# EAGLE design bluenumi (EAGLE 6.1)
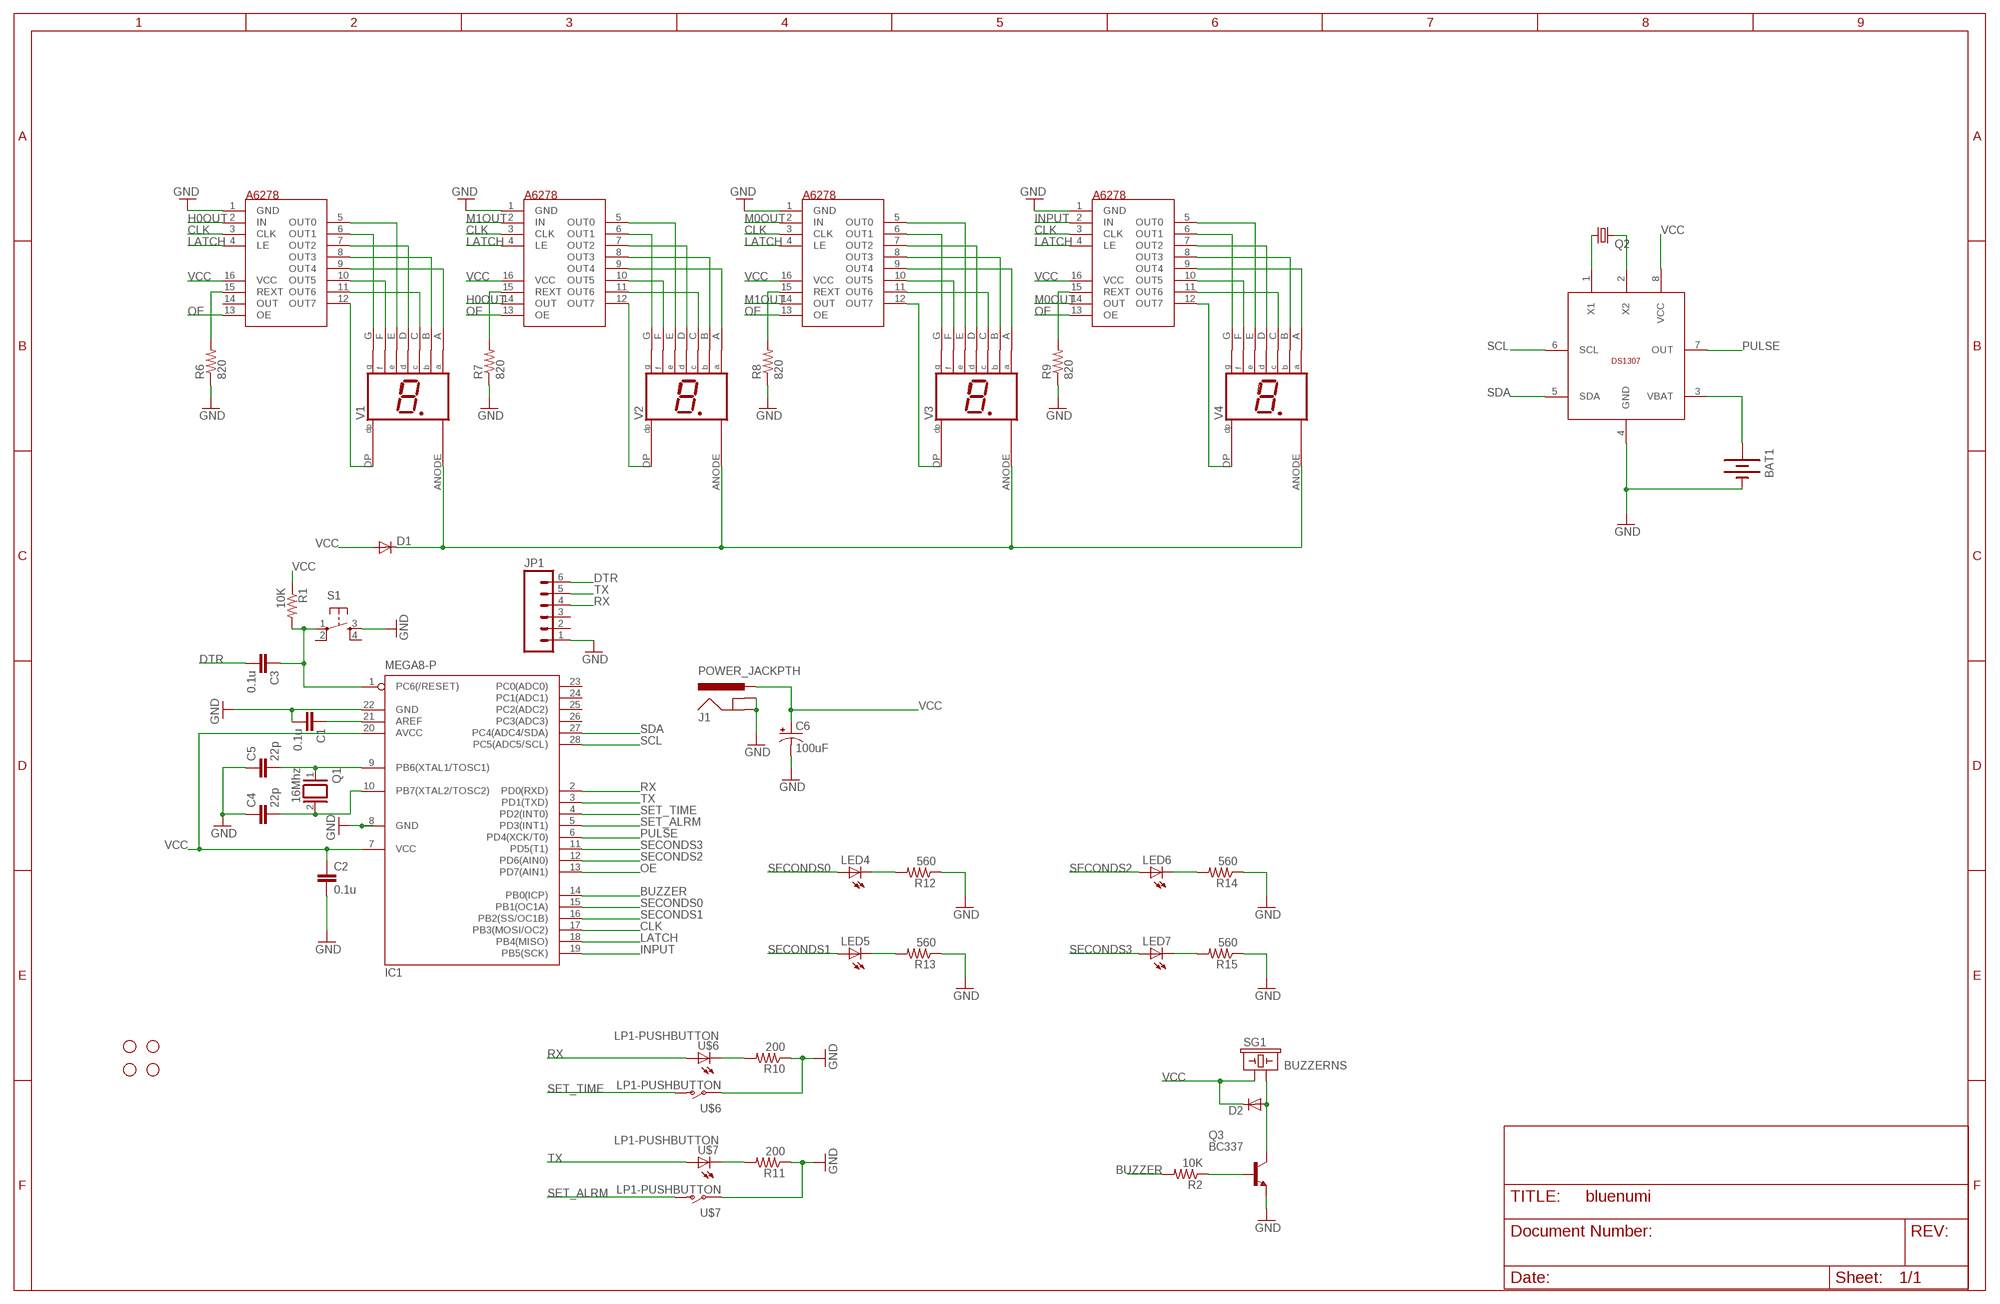
[diagram p0: schematic, sheet 1]

## Parts
BAT1  BATTERY20PTH  [BATTCOM_20MM_PTH]
C1  0.1u  CAPPTH  [CAP-PTH-SMALL]
C2  0.1u  CAPPTH  [CAP-PTH-SMALL]
C3  0.1u  CAPPTH  [CAP-PTH-SMALL]
C4  22p  CAPPTH  [CAP-PTH-SMALL]
C5  22p  CAPPTH  [CAP-PTH-SMALL]
C6  100uF  CAP_POLPTH2  [CPOL-RADIAL-10UF-25V]
D1  DIODEPTH  [DIODE-1N4001]
D2  DIODEPTH  [DIODE-1N4001]
IC1  MEGA8-P  [DIL28-3]
J1  POWER_JACKPTH  [POWER_JACK_PTH]
JP1  M06LOCK  [1X06_LOCK]
LED4  LED5MM  [LED5MM]
LED5  LED5MM  [LED5MM]
LED6  LED5MM  [LED5MM]
LED7  LED5MM  [LED5MM]
Q1  16Mhz  XTAL/S  [QS]
Q2  CRYSTALTC26H  [TC26H]
Q3  BC337  [TO92]
R1  10K  RESISTORPTH1  [AXIAL-0.3]
R2  10K  RESISTORPTH1  [AXIAL-0.3]
R6  820  RESISTORPTH1  [AXIAL-0.3]
R7  820  RESISTORPTH1  [AXIAL-0.3]
R8  820  RESISTORPTH1  [AXIAL-0.3]
R9  820  RESISTORPTH1  [AXIAL-0.3]
R10  200  RESISTORPTH1  [AXIAL-0.3]
R11  200  RESISTORPTH1  [AXIAL-0.3]
R12  560  RESISTORPTH1  [AXIAL-0.3]
R13  560  RESISTORPTH1  [AXIAL-0.3]
R14  560  RESISTORPTH1  [AXIAL-0.3]
R15  560  RESISTORPTH1  [AXIAL-0.3]
S1  TAC_SWITCHPTH  [TACTILE-PTH]
SG1  BUZZERNS  [BUZZER-12MM-NS]
U$1  TLC5916  A6278EAT  [DIL16]
U$2  A6278EAT  [DIL16]
U$3  A6278EAT  [DIL16]
U$4  A6278EAT  [DIL16]
U$5  DS1307  [DIL08]
U$6  LP1-PUSHBUTTON  [LP1-PUSHBUTTON]
U$7  LP1-PUSHBUTTON  [LP1-PUSHBUTTON]
U$8  STAND-OFF  [STAND-OFF]
U$9  STAND-OFF  [STAND-OFF]
U$10  STAND-OFF  [STAND-OFF]
U$11  STAND-OFF  [STAND-OFF]
V1  IV-9-UNDERLIT  [9PINTUBE-WIDE]
V2  IV-9-UNDERLIT  [9PINTUBE-WIDE]
V3  IV-9-UNDERLIT  [9PINTUBE-WIDE]
V4  IV-9-UNDERLIT  [9PINTUBE-WIDE]

## Nets
BUZZER: IC1.14(PB0(ICP)) R2.P$2
CLK: IC1.17(PB3(MOSI/OC2)) U$1.3(CLK) U$2.3(CLK) U$3.3(CLK) U$4.3(CLK)
DTR: C3.2 JP1.6
GND: BAT1.2(-) C1.2 C2.2 C4.1 C5.1 C6.2(-) IC1.8(GND) IC1.22(GND) J1.GND J1.GNDBREAK JP1.1 Q3.1(E) R6.P$1 R7.P$1 R8.P$1 R9.P$1 R10.P$1 R11.P$1 R12.P$1 R13.P$1 R14.P$1 R15.P$1 S1.3 U$1.1(GND) U$2.1(GND) U$3.1(GND) U$4.1(GND) U$5.4(GND) U$6.S2 U$7.S2
H0OUT: U$1.2(IN) U$2.14(OUT)
INPUT: IC1.19(PB5(SCK)) U$4.2(IN)
LATCH: IC1.18(PB4(MISO)) U$1.4(LE) U$2.4(LE) U$3.4(LE) U$4.4(LE)
M0OUT: U$3.2(IN) U$4.14(OUT)
M1OUT: U$2.2(IN) U$3.14(OUT)
N$1: U$1.5(OUT0) V1.E
N$2: U$1.6(OUT1) V1.G
N$3: U$1.7(OUT2) V1.D
N$4: U$1.8(OUT3) V1.B
N$5: U$1.9(OUT4) V1.A
N$6: U$1.10(OUT5) V1.F
N$7: U$1.11(OUT6) V1.C
N$8: U$1.12(OUT7) V1.DP
N$9: R11.P$2 U$7.CATHODE
N$10: U$2.12(OUT7) V2.DP
N$11: C5.2 IC1.9(PB6(XTAL1/TOSC1)) Q1.1
N$12: U$2.6(OUT1) V2.G
N$13: U$2.5(OUT0) V2.E
N$14: U$2.7(OUT2) V2.D
N$15: U$2.8(OUT3) V2.B
N$16: U$2.9(OUT4) V2.A
N$17: U$2.10(OUT5) V2.F
N$18: U$2.11(OUT6) V2.C
N$19: D1.C V1.ANODE V2.ANODE V3.ANODE V4.ANODE
N$20: Q2.1 U$5.1(X1)
N$21: Q2.2 U$5.2(X2)
N$22: C4.2 IC1.10(PB7(XTAL2/TOSC2)) Q1.2
N$23: C3.1 IC1.1(PC6(/RESET)) R1.P$2 S1.1
N$24: C1.1 IC1.21(AREF)
N$25: U$3.12(OUT7) V3.DP
N$26: U$3.11(OUT6) V3.C
N$27: U$3.10(OUT5) V3.F
N$28: U$3.9(OUT4) V3.A
N$29: U$3.8(OUT3) V3.B
N$30: U$3.7(OUT2) V3.D
N$31: U$3.6(OUT1) V3.G
N$32: U$3.5(OUT0) V3.E
N$33: R6.P$2 U$1.15(REXT)
N$34: Q3.2(B) R2.P$1
N$35: D2.A Q3.3(C) SG1.-
N$37: R7.P$2 U$2.15(REXT)
N$38: R8.P$2 U$3.15(REXT)
N$39: R9.P$2 U$4.15(REXT)
N$40: R10.P$2 U$6.CATHODE
N$41: U$4.11(OUT6) V4.C
N$42: U$4.10(OUT5) V4.F
N$43: U$4.9(OUT4) V4.A
N$44: U$4.8(OUT3) V4.B
N$45: U$4.7(OUT2) V4.D
N$46: U$4.6(OUT1) V4.G
N$47: U$4.5(OUT0) V4.E
N$48: LED4.K(C) R12.P$2
N$49: U$4.12(OUT7) V4.DP
N$50: LED5.K(C) R13.P$2
N$51: LED6.K(C) R14.P$2
N$52: LED7.K(C) R15.P$2
N$54: BAT1.1(+) U$5.3(VBAT)
OE: IC1.13(PD7(AIN1)) U$1.13(OE) U$2.13(OE) U$3.13(OE) U$4.13(OE)
PULSE: IC1.6(PD4(XCK/T0)) U$5.7(OUT)
RX: IC1.2(PD0(RXD)) JP1.4 U$6.ANODE
SCL: IC1.28(PC5(ADC5/SCL)) U$5.6(SCL)
SDA: IC1.27(PC4(ADC4/SDA)) U$5.5(SDA)
SECONDS0: IC1.15(PB1(OC1A)) LED4.A
SECONDS1: IC1.16(PB2(SS/OC1B)) LED5.A
SECONDS2: IC1.12(PD6(AIN0)) LED6.A
SECONDS3: IC1.11(PD5(T1)) LED7.A
SET_ALRM: IC1.5(PD3(INT1)) U$7.S1
SET_TIME: IC1.4(PD2(INT0)) U$6.S1
TX: IC1.3(PD1(TXD)) JP1.5 U$7.ANODE
VCC: C2.1 C6.1(+) D1.A D2.C IC1.7(VCC) IC1.20(AVCC) J1.PWR R1.P$1 SG1.+ U$1.16(VCC) U$2.16(VCC) U$3.16(VCC) U$4.16(VCC) U$5.8(VCC)
Unconnected: IC1.23(PC0(ADC0)) IC1.24(PC1(ADC1)) IC1.25(PC2(ADC2)) IC1.26(PC3(ADC3)) JP1.2 JP1.3 S1.2 S1.4 U$1.14(OUT)

## Library data of the parts
BAT1 = SparkFun:BATTERY: Battery Holders Various common sizes : AA, AAA, 20mm coin cell and 12mm coin cell.
C1-C5 = SparkFun:CAP: Capacitor Standard 0603 ceramic capacitor, and 0.1" leaded capacitor.
C6 = SparkFun:CAP_POL: Capacitor Polarized These are standard SMD and PTH capacitors. Normally 10uF, 47uF, and 100uF in electrolytic and tantalum varieties. Always verify the external diameter of the through hole cap, it varies with capacity, voltage, and manufacturer. The EIA devices should be standard.
D1 D2 = SparkFun:DIODE: Diode These are standard reverse protection diodes and small signal diodes. SMA package can handle up to about 1A. SOD-323 can handle about 200mA. What the SOD-323 package when ordering, there are some mfgs out there that are 5-pin packages.
IC1 = atmel:MEGA8-P: MICROCONTROLLER 8 Kbytes FLASH, 1 kbytes SRAM, 512 bytes EEPROM, USART, 4-channel 10 bit ADC, 2-channel 8 bit ADC Pin compatible with Atmega48, ATMega88, ATMega168 Source: avr.lbr
J1 = SparkFun:POWER_JACK: Power Jack This is the standard 5.5mm barrel jack for power. The PTH is the most common, proven, reliable, footprint. All others are experimental. The Slot footprint only works if the mill layer is transmitted to the PCB fab house so be warned. Spark Fun Electronics SKU : PRT-00119. Mating wall wart : TOL-00298 (and others)
JP1 = SparkFun:M06: Header 6 Standard 6-pin 0.1" header. Use with straight break away headers (SKU : PRT-00116), right angle break away headers (PRT-00553), swiss pins (PRT-00743), machine pins (PRT-00117), and female headers (PRT-00115). Molex polarized connector foot print use with SKU : PRT-08094 with associated crimp pins and housings. NOTES ON THE VARIANTS LOCK and LOCK_LONGPADS... This footprint was designed to help hold the alignment of a through-hole component (i.e. 6-pin header) while soldering it into place. You may notice that each hole has been shifted either up or down by 0.005 of an inch from it's more standard position (which is a perfectly straight line). This slight alteration caused the pins (the squares in the middle) to touch the edges of the holes. Because they are alternating, it causes a "brace" to hold the component in place. 0.005 has proven to be the perfect amount of "off-center" position when using our standard breakaway headers. Although looks a little odd when you look at the bare footprint, once you have a header in there, the alteration is very hard to notice. Also, if you push a header all the way into place, it is covered up entirely on the bottom side. This idea of altering the position of holes to aid alignment will be further integrated into the Sparkfun Library for other footprints. It can help hold any component with 3 or more connection pins.
LED4-LED7 = led:LED: LED OSRAM: - CHIPLED LG R971, LG N971, LY N971, LG Q971, LY Q971, LO R971, LY R971 LH N974, LH R974 LS Q976, LO Q976, LY Q976 LO Q996 - Hyper CHIPLED LW Q18S LB Q993, LB Q99A, LB R99A - SideLED LS A670, LO A670, LY A670, LG A670, LP A670 LB A673, LV A673, LT A673, LW A673 LH A674 LY A675 LS A676, LA A676, LO A676, LY A676, LW A676 LS A679, LY A679, LG A679 - Hyper Micro SIDELED® LS Y876, LA Y876, LO Y876, LY Y876 LT Y87S - SmartLED LW L88C, LW L88S LB L89C, LB L89S, LG L890 LS L89K, LO L89K, LY L89K LS L896, LA L896, LO L896, LY L896 - TOPLED LS T670, LO T670, LY T670, LG T670, LP T670 LSG T670, LSP T670, LSY T670, LOP T670, LYG T670 LG T671, LOG T671, LSG T671 LB T673, LV T673, LT T673, LW T673 LH T674 LS T676, LA T676, LO T676, LY T676, LB T676, LH T676, LSB T676, LW T676 LB T67C, LV T67C, LT T67C, LS T67K, LO T67K, LY T67K, LW E67C LS E67B, LA E67B, LO E67B, LY E67B, LB E67C, LV E67C, LT E67C LW T67C LS T679, LY T679, LG T679 LS T770, LO T770, LY T770, LG T770, LP T770 LB T773, LV T773, LT T773, LW T773 LH T774 LS E675, LA E675, LY E675, LS T675 LS T776, LA T776, LO T776, LY T776, LB T776 LHGB T686 LT T68C, LB T68C - Hyper Mini TOPLED® LB M676 - Mini TOPLED Santana® LG M470 LS M47K, LO M47K, LY M47K Source: http://www.osram.convergy.de LUXEON: - LUMILED® LXK2-PW12-R00, LXK2-PW12-S00, LXK2-PW14-U00, LXK2-PW14-V00 LXK2-PM12-R00, LXK2-PM12-S00, LXK2-PM14-U00 LXK2-PE12-Q00, LXK2-PE12-R00, LXK2-PE12-S00, LXK2-PE14-T00, LXK2-PE14-U00 LXK2-PB12-K00, LXK2-PB12-L00, LXK2-PB12-M00, LXK2-PB14-N00, LXK2-PB14-P00, LXK2-PB14-Q00 LXK2-PR12-L00, LXK2-PR12-M00, LXK2-PR14-Q00, LXK2-PR14-R00 LXK2-PD12-Q00, LXK2-PD12-R00, LXK2-PD12-S00 LXK2-PH12-R00, LXK2-PH12-S00 LXK2-PL12-P00, LXK2-PL12-Q00, LXK2-PL12-R00 Source: www.luxeon.com KINGBRIGHT: KA-3528ASYC Source: www.kingbright.com
Q1 = special:XTAL/S: CRYSTAL
Q2 = crystal:CRYSTAL: CRYSTAL
Q3 = transistor-npn:BC337*: NPN Transistor
R1 R2 R6-R15 = SparkFun:RESISTOR: Resistor Basic schematic elements and footprints for 0603, 1206, and PTH 1/10th watt (small) resistors.
S1 = SparkFun:TAC_SWITCH: Momentary Switch Button commonly used for reset or general input. Spark Fun Electronics SKU : COM-00097
SG1 = SparkFun:BUZZER: Buzzer 12mm Spark Fun Electronics SKU : Comp-Buzzer
U$1-U$4 = SeanVoisen:A6278: Allegro A6278 DIP-16 LED driver.
U$5 = SeanVoisen:DS1307: DS1307 Maxim Dallas RTC
U$6 U$7 = SeanVoisen:LP1-PUSHBUTTON
U$8-U$11 = SparkFun:STAND-OFF: Stand Off This is the mechanical footprint for a #4 phillips button head screw. Use the keepout ring to avoid running the screw head into surrounding components. SKU : PRT-00447
V1-V4 = SeanVoisen:IV-9-UNDERLIT

## Board
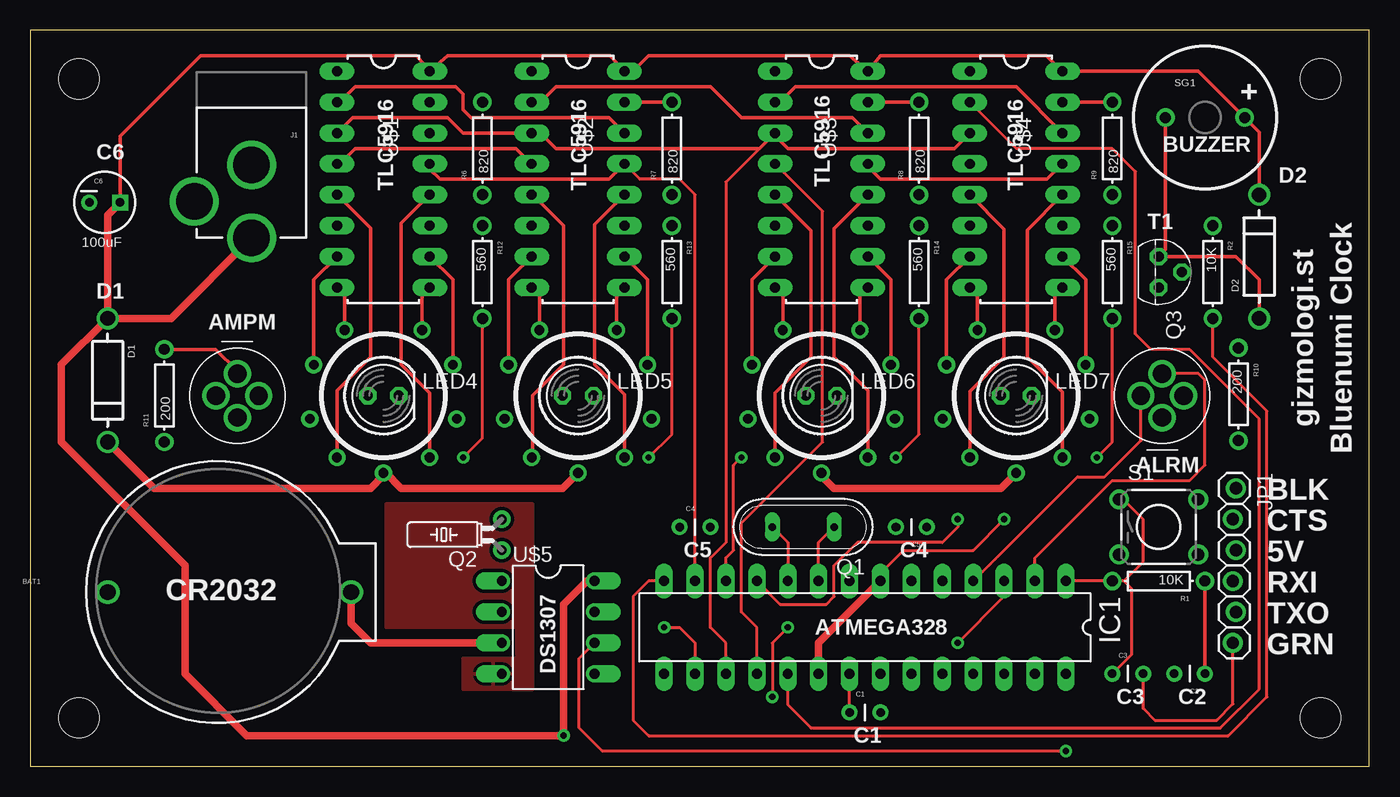
[diagram p1: board, top side]
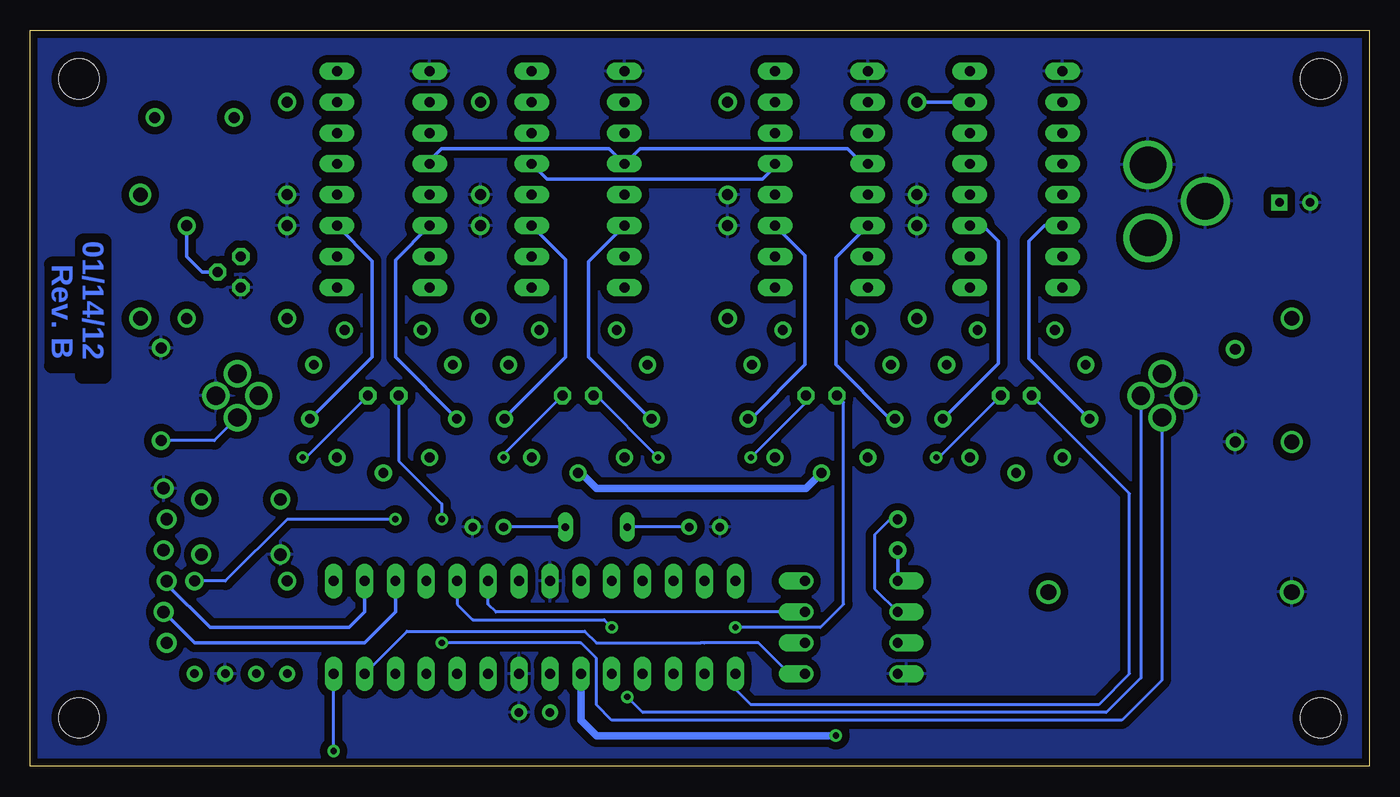
[diagram p2: board, bottom side, seen from below]

Size 110 x 60.5 mm. Coordinates in mm from the lower left corner, seen from the top.
Outline: 0,0 110,0 110,60.5 0,60.5 0,0
Copper layers (1*16): Top 0.035mm / dielectric 1.5mm / Bottom 0.035mm
Design rules: minimum track width 8mil, minimum drill 20mil, track to track 8mil, track to pad 8mil, pad to pad 8mil, via to via 8mil, smd to smd 8mil, copper to edge 10mil, drill to drill 8mil, minimum pad ring 12mil, minimum via ring 10mil, stop-mask expansion 4mil, vias tented up to drill 25mil, thermal gap 10mil

### Footprints (pad centres in the part's own frame; a part is rotated, then mirrored left to right if it is on the bottom)
BATTCOM_20MM_PTH = drill 1.3: 1 20,0; 2 0,0
CAP-PTH-SMALL = drill 0.7: 1 0,0; 2 2.54,0
CPOL-RADIAL-10UF-25V = drill 0.7 square: 1 1.27,0 | drill 0.7: 2 -1.27,0
DIODE-1N4001 = drill 1.2: A -5.08,0; C 5.08,0
DIL28-3 = drill 0.813 long: 1 -16.51,-3.81; 2 -13.97,-3.81; 3 -11.43,-3.81; 4 -8.89,-3.81; 5 -6.35,-3.81; 6 -3.81,-3.81; 7 -1.27,-3.81; 8 1.27,-3.81; 9 3.81,-3.81; 10 6.35,-3.81; 11 8.89,-3.81; 12 11.43,-3.81; 13 13.97,-3.81; 14 16.51,-3.81; 15 16.51,3.81; 16 13.97,3.81; 17 11.43,3.81; 18 8.89,3.81; 19 6.35,3.81; 20 3.81,3.81; 21 1.27,3.81; 22 -1.27,3.81; 23 -3.81,3.81; 24 -6.35,3.81; 25 -8.89,3.81; 26 -11.43,3.81; 27 -13.97,3.81; 28 -16.51,3.81
POWER_JACK_PTH = drill 2.997: GND 0,7.7; GNDBREAK 4.7,10.7; PWR 0,13.7
1X06_LOCK = drill 1.016: 1 0,0; 2 2.54,-0.254; 3 5.08,0; 4 7.62,-0.254; 5 10.16,0; 6 12.7,-0.254
LED5MM = drill 0.813 octagon: A -1.27,0; K 1.27,0
QS = drill 0.61 long: 1 -2.54,0; 2 2.54,0
TC26H = drill 0.813: 1 -1.27,0; 2 1.27,0
TO92 = drill 0.813 octagon: 1 1.27,0; 2 0,1.905; 3 -1.27,0
AXIAL-0.3 = drill 0.9: P$1 -3.81,0; P$2 3.81,0
TACTILE-PTH = drill 1.016: 1 -3.251,2.261; 2 3.251,2.261; 3 -3.251,-2.261; 4 3.251,-2.261
BUZZER-12MM-NS = drill 0.9: + 3.25,0; - -3.25,0
DIL16 = drill 0.813 long: 1 -8.89,-3.81; 2 -6.35,-3.81; 3 -3.81,-3.81; 4 -1.27,-3.81; 5 1.27,-3.81; 6 3.81,-3.81; 7 6.35,-3.81; 8 8.89,-3.81; 9 8.89,3.81; 10 6.35,3.81; 11 3.81,3.81; 12 1.27,3.81; 13 -1.27,3.81; 14 -3.81,3.81; 15 -6.35,3.81; 16 -8.89,3.81
DIL08 = drill 0.813 offset: 1 -3.81,-3.81; 2 -1.27,-3.81; 3 1.27,-3.81; 4 3.81,-3.81; 5 3.81,3.81; 6 1.27,3.81; 7 -1.27,3.81; 8 -3.81,3.81
LP1-PUSHBUTTON = drill 1.5: ANODE 0,1.803; CATHODE 0,-1.803; S1 -1.753,0; S2 1.753,0
STAND-OFF = hole 3.302: 0,0
9PINTUBE-WIDE = drill 0.8: A 3.175,5.397; ANODE 0,-6.35; B -3.175,5.397; C 6.032,-1.905; D -5.715,2.54; DP 3.81,-5.08; E -3.81,-5.08; F 5.715,2.54; G -6.032,-1.905

### Placement (x,y rotation side)
BAT1  6.35,14.34 0 top
C1  67.31,4.45 0 top
C2  96.52,7.62 180 top
C3  88.9,7.62 0 top
C4  53.34,19.68 0 top
C5  73.66,19.68 180 top
C6  6.11,46.35 0 top
D1  6.35,31.75 270 top
D2  100.97,41.91 90 top
IC1  68.58,11.43 180 top
J1  18.17,57.15 180 top
JP1  99.06,22.86 270 top
LED4  29,30.48 0 top
LED5  45,30.48 0 top
LED6  65,30.48 0 top
LED7  81,30.48 0 top
Q1  63.5,19.68 180 top
Q2  38.73,19.05 90 top
Q3  92.71,40.64 270 top
R1  92.71,15.24 180 top
R2  97.16,40.64 270 top
R6  37.15,50.8 90 top
R7  52.7,50.8 90 top
R8  73.03,50.8 90 top
R9  88.9,50.8 90 top
R10  99.27,30.59 270 top
R11  11,30.48 90 top
R12  37.15,40.64 270 top
R13  52.7,40.64 270 top
R14  73.03,40.64 270 top
R15  88.9,40.64 270 top
S1  92.71,19.68 0 top
SG1  96.52,53.34 0 top
U$1  29,48.26 270 top
U$2  45,48.26 270 top
U$3  65,48.26 270 top
U$4  81,48.26 270 top
U$5  42.55,11.43 270 top
U$6  93,30.48 0 top
U$7  17,30.48 180 top
U$8  4,4 0 top
U$9  4,56.5 0 top
U$10  106,56.5 0 top
U$11  106,4 0 top
V1  29,30.48 0 top
V2  45,30.48 0 top
V3  65,30.48 0 top
V4  81,30.48 0 top

### Tracks (layer width: path | path; a pad name or v marks a point on that pad's centre or on a via)
BUZZER
  Top 0.254: IC1.14 50.8,15.24 49.53,13.97 49.53,3.81 50.8,2.54 98.42,2.54 101.6,5.71 101.6,29.21 97.16,33.66 R2.P$2
CLK
  Top 0.254: 60.44,51.32 57.15,48.03 57.15,18.41 56.83,18.1 55.88,17.14 55.88,11.43 57.15,10.16 IC1.17
  Top 0.305: U$4.3 75.92,50.8 62.23,50.8 61.19,51.84 U$3.3 60.44,51.32 59.92,50.8 43.18,50.8 41.91,52.07 U$2.3 35.56,52.07 34.29,53.34 26.46,53.34 U$1.3
DTR
  Top 0.254: JP1.6 98.81,5.14 97.47,3.81 92.39,3.81 91.44,4.76 C3.2
GND
  pour Bottom (isolate 0.61): 0,0 0,60.5 110,60.5 110,0
  pour Top (isolate 0.305): 40.01,8.89 35.56,8.89 35.56,6.35 41.27,6.35 41.27,21.59 29.21,21.59 29.21,11.43 40.01,11.43
H0OUT
  Top 0.305: U$1.2 25.4,54.61 26.67,55.88 34.92,55.88 35.56,55.24 35.56,53.98 36.2,53.34 47.54,53.34 U$2.14
INPUT
  Top 0.254: IC1.19 62.23,5.08 64.14,3.17 97.79,3.17 100.97,6.35 100.97,28.57 95.25,34.29 92.08,34.29 90.81,35.56 90.81,48.9 88.9,50.8 81,50.8 U$4.2
LATCH
  Top 0.254: IC1.18 59.69,11.43 58.42,12.7 58.42,20 65.09,26.67 65.09,45.63 U$3.4
  Top 0.305: U$1.4 25.4,49.53 26.67,50.8 39.92,50.8 U$2.4
  Bottom 0.305: U$4.4 77.19,49.81 76.2,50.8 62.46,50.8 U$3.4 59.92,50.8 42.86,50.8 41.59,49.53 U$2.4
M0OUT
  Top 0.305: U$3.2 61.59,54.61 62.87,55.88 81,55.88 U$4.14
M1OUT
  Top 0.305: U$2.2 41.91,54.61 43.18,55.88 55.88,55.88 58.42,53.34 67.54,53.34 U$3.14
N$1
  Top 0.305: V1.E 25.19,30.91 27.94,33.66 27.94,44.24 U$1.5
N$2
  Bottom 0.305: U$1.6 26.67,44.45 27.94,43.18 27.94,33.55 V1.G
N$3
  Top 0.305: V1.D 23.29,40.01 U$1.7
N$4
  Top 0.305: V1.B 25.82,38.73 U$1.8
N$5
  Top 0.305: V1.A 32.17,38.73 U$1.9
N$6
  Top 0.305: V1.F 34.72,40.01 U$1.10
N$7
  Bottom 0.305: U$1.11 31.75,44.45 30.48,43.18 30.48,33.13 V1.C
N$8
  Top 0.305: V1.DP 32.81,30.69 30.48,33.02 30.48,44.66 U$1.12
N$9
  Top 0.305: U$7.CATHODE 17,32.53 15.24,34.29 R11.P$2
N$10
  Top 0.305: V2.DP 48.81,30.57 46.35,33.02 46.35,44.53 U$2.12
N$11
  Top 0.254: IC1.9 64.77,18.41 Q1.1
  Bottom 0.254: Q1.1 C5.2
N$12
  Bottom 0.305: V2.G 39.37,28.57 43.81,33.02 43.81,41.83 U$2.6
N$13
  Top 0.305: U$2.5 41.27,46.99 43.81,44.45 43.81,33.02 41.27,30.48 41.27,25.48 V2.E
N$14
  Top 0.305: V2.D 39.28,40.01 U$2.7
N$15
  Top 0.305: V2.B 41.83,38.73 U$2.8
N$16
  Top 0.305: V2.A 48.17,38.73 U$2.9
N$17
  Top 0.305: V2.F 50.72,40.01 U$2.10
N$18
  Bottom 0.305: V2.C 50.8,28.57 46.35,33.02 46.35,41.99 U$2.11
N$19
  Top 0.61: V2.ANODE 43.73,22.86 30.48,22.86 29.21,24.13 V1.ANODE 29,23.92 27.94,22.86 10.16,22.86 D1.C | V3.ANODE 65,23.9 66.04,22.86 79.73,22.86 V4.ANODE
  Bottom 0.61: V2.ANODE 46.27,22.86 63.5,22.86 64.77,24.13 V3.ANODE
N$20
  Bottom 0.305: U$5.1 Q2.1
N$21
  Bottom 0.254: Q2.2 39.37,20.32 40.64,19.05 40.64,14.61 U$5.2
N$22
  Top 0.254: IC1.10 62.23,18.41 Q1.2
  Bottom 0.254: C4.2 Q1.2
N$23
  Top 0.254: S1.1 89.81,21.95 91.44,20.32 91.44,16.83 89.85,15.24 | 89.85,15.24 R1.P$2 IC1.1 | C3.1 90.49,9.21 90.49,14.61 89.85,15.24
N$24
  Top 0.254: C1.1 IC1.21
N$25
  Top 0.305: V3.DP 68.81,30.89 66.04,33.66 66.04,44.22 U$3.12
N$26
  Bottom 0.305: V3.C 71.03,28.66 66.04,33.66 66.04,41.68 U$3.11
N$27
  Top 0.305: V3.F 70.72,40.01 U$3.10
N$28
  Top 0.305: V3.A 68.17,38.73 U$3.9
N$29
  Top 0.305: V3.B 61.83,38.73 U$3.8
N$30
  Top 0.305: V3.D 59.28,40.01 U$3.7
N$31
  Bottom 0.305: V3.G 59.05,28.57 64.14,33.66 64.14,41.51 U$3.6
N$32
  Top 0.305: V3.E 61.19,30.71 64.14,33.66 64.14,44.05 U$3.5
N$33
  Bottom 0.305: U$1.15 R6.P$2
N$34
  Bottom 0.305: Q3.2 95.89,40.64 97.16,41.91 R2.P$1
N$35
  Top 0.305: SG1.- 93.27,42.47 Q3.3 99.06,41.91 100.97,40.01 D2.A
N$37
  Top 0.305: U$2.15 R7.P$2
N$38
  Top 0.305: U$3.15 R8.P$2
N$39
  Top 0.305: U$4.15 R9.P$2
N$40
  Bottom 0.254: R10.P$2 94.9,26.78 U$6.CATHODE
N$41
  Bottom 0.305: V4.C 87,28.57 81.92,33.66 81.92,41.55 U$4.11
N$42
  Top 0.305: V4.F 86.72,40.01 U$4.10
N$43
  Top 0.305: V4.A 84.17,38.73 U$4.9
N$44
  Top 0.305: V4.B 77.83,38.73 U$4.8
N$45
  Top 0.305: V4.D 75.28,40.01 U$4.7
N$46
  Bottom 0.305: V4.G 74.97,28.61 80.01,33.66 80.01,41.63 U$4.6
N$47
  Top 0.305: V4.E 77.19,30.84 80.01,33.66 80.01,44.17 U$4.5
N$48  (via drill 0.51)
  Top 0.254: R12.P$2 37.15,26.99 v35.56,25.4
  Bottom 0.254: v35.56,25.4 35.35,25.4 LED4.K
N$49
  Top 0.305: V4.DP 84.81,30.76 81.92,33.66 81.92,44.09 U$4.12
N$50  (via drill 0.51)
  Top 0.254: R13.P$2 52.7,27.3 v50.8,25.4
  Bottom 0.254: v50.8,25.4 46.27,29.93 LED5.K
N$51  (via drill 0.51)
  Top 0.254: R14.P$2 73.03,27.3 v71.12,25.4
  Bottom 0.254: v71.12,25.4 71.12,25.63 LED6.K
N$52  (via drill 0.51)
  Top 0.254: R15.P$2 88.9,26.67 v87.63,25.4
  Bottom 0.254: v87.63,25.4 87.35,25.4 LED7.K
N$54
  Top 0.61: BAT1.1 26.35,11.75 27.94,10.16 U$5.3
OE
  Top 0.254: IC1.13 54.61,46.99 53.34,48.26 50.08,48.26 U$2.13
  Top 0.305: U$1.13 32.81,49.1 33.66,48.26 47.54,48.26 U$2.13 | U$3.13 68.81,49.3 69.85,48.26 83.54,48.26 U$4.13
  Bottom 0.305: U$2.13 48.81,49.3 49.85,48.26 67.54,48.26 U$3.13
PULSE
  Bottom 0.254: U$5.7 71.75,12.7 72.39,13.34 IC1.6
RX
  Top 0.254: IC1.2 82.55,17.14 88.9,23.5 95.25,23.5 96.52,24.77 96.52,31.75 95.99,32.28 U$6.ANODE
  Bottom 0.305: JP1.4 98.81,14.99 95.25,11.43 83.82,11.43 82.55,12.7 IC1.2
SCL  (via drill 0.51)
  Top 0.254: U$5.6 45.09,8.89 45.09,3.17 46.99,1.27 v85.09,1.27
  Bottom 0.254: v85.09,1.27 IC1.28
SDA
  Bottom 0.254: IC1.27 79.06,11.11 64.45,11.11 63.5,10.16 54.93,10.16 54.61,10.16 50.16,10.16 47.62,7.62 U$5.5
SECONDS0
  Bottom 0.254: IC1.15 52.07,6.35 50.8,5.08 22.23,5.08 19.68,7.62 19.68,22.43 LED4.A
SECONDS1  (via drill 0.51)
  Top 0.254: IC1.16 54.61,10.16 53.34,11.43 v52.07,11.43
  Bottom 0.254: v52.07,11.43 45.09,11.43 43.18,13.34 43.18,29.93 LED5.A
SECONDS2  (via drill 0.51)
  Top 0.254: IC1.12 57.15,17.14 57.78,17.78 57.78,24.77 v58.42,25.4
  Bottom 0.254: LED6.A 63.5,30.48 v58.42,25.4
SECONDS3  (via drill 0.51)
  Top 0.254: IC1.11 61.59,13.34 65.41,13.34 66.04,13.97 66.04,16.51 67.94,18.41 74.93,18.41 76.2,19.68 v76.2,20.32
  Bottom 0.254: LED7.A 79.73,25.12 76.2,21.59 v76.2,20.32
SET_ALRM  (via drill 0.51)
  Top 0.254: v62.23,11.43 60.96,10.16 v60.96,5.71
  Bottom 0.254: U$7.S1 18.75,7.28 21.59,4.45 59.69,4.45 v60.96,5.71 | IC1.5 74.93,13.34 73.66,12.06 62.87,12.06 v62.23,11.43
SET_TIME
  Top 0.254: U$6.S1 91.25,26.8 88.27,23.81 86.04,23.81 IC1.4
TX  (via drill 0.51)
  Top 0.254: IC1.3 80.01,13.97 v76.2,10.16
  Bottom 0.254: U$7.ANODE 17,7.13 20.32,3.81 62.23,3.81 63.5,5.08 63.5,8.89 64.77,10.16 v76.2,10.16
  Bottom 0.305: JP1.5 96.52,10.16 82.55,10.16 80.01,12.7 IC1.3 80.01,13.97
VCC  (via drill 0.51)
  Top 0.254: IC1.7 69.85,15.88 71.75,17.78 77.47,17.78 v80.01,20.32
  Top 0.305: C2.1 R1.P$1 | D2.C 100.97,52.15 SG1.+ 95.96,57.15 U$4.16 83.5,58.42 69.85,58.42 U$3.16 67.31,58.42 50.8,58.42 49.53,57.15 U$2.16 47.62,58.42 34.29,58.42 U$1.16 31.75,58.42 13.97,58.42 7.38,51.83 C6.1
  Top 0.61: 18.05,43.45 J1.PWR 11.55,36.83 D1.A | IC1.20 64.77,10.16 IC1.7 | U$5.8 45.72,15.24 43.81,13.34 v43.81,2.54 17.78,2.54 12.7,7.62 12.7,16.51 2.54,26.67 2.54,33.02 D1.A | D1.A 6.35,45.33 C6.1
  Bottom 0.254: v80.01,20.32 88.9,20.32 93.98,15.24 R1.P$1
  Bottom 0.61: IC1.20 64.77,3.81 63.5,2.54 v43.81,2.54

### Text on the board
Bottom: 01/14/12 | Rev. B
tPlace: + | C6 | BUZZER | TLC5916 | D2 | TLC5916 | TLC5916 | TLC5916 | T1 | D1 | AMPM | gizmologi.st | Bluenumi Clock | ALRM | BLK | CTS | C5 | C4 | 5V | CR2032 | RXI | TXO | ATMEGA328 | GRN | DS1307 | C3 | C2 | C1